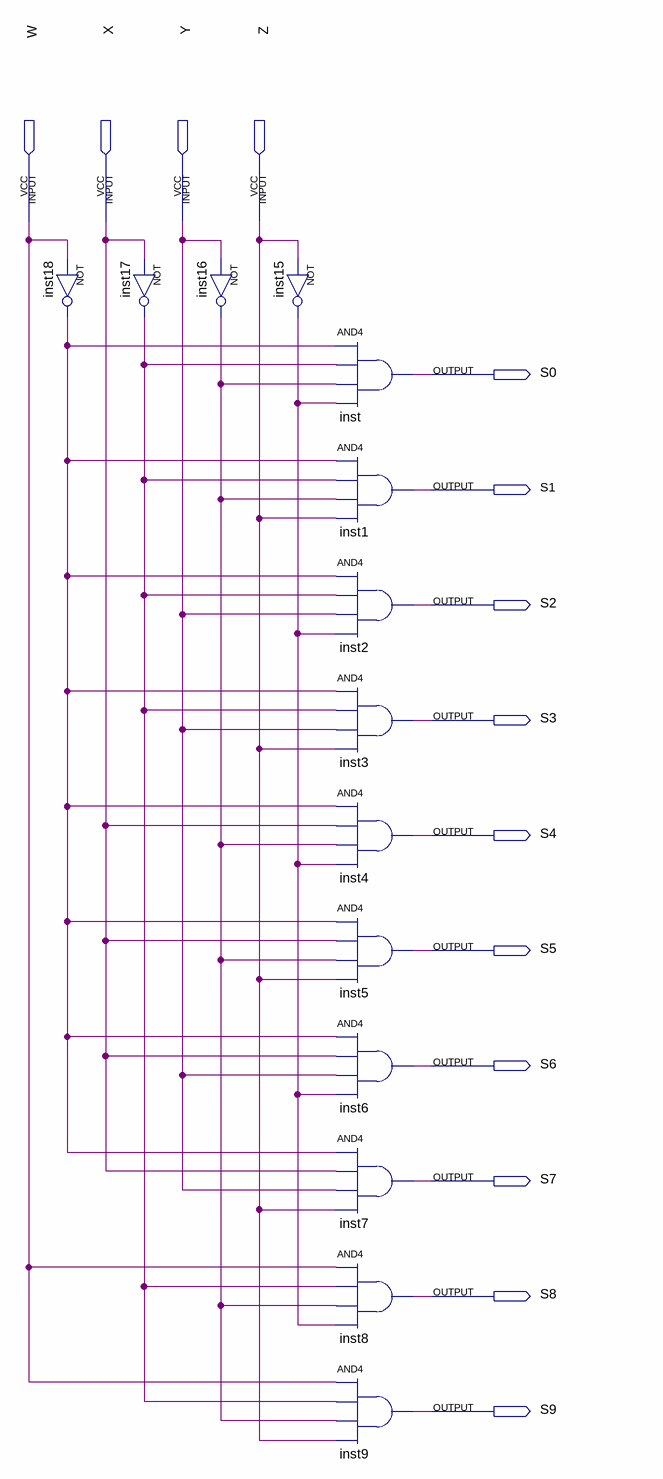
[diagram p0: schematic sheet]
// Quartus schematic Decodificador4_9.bdf as structural Verilog: 14 symbols, 14 pins
module Decodificador4_9 (
  input  W,
  input  X,
  input  Y,
  input  Z,
  output S0,
  output S1,
  output S2,
  output S3,
  output S4,
  output S5,
  output S6,
  output S7,
  output S8,
  output S9
);

  wire inst15_out, inst16_out, inst17_out, inst18_out;

  not inst18 (inst18_out, W);
  not inst17 (inst17_out, X);
  not inst16 (inst16_out, Y);
  not inst15 (inst15_out, Z);
  and inst (S0, inst18_out, inst17_out, inst16_out, inst15_out);
  and inst1 (S1, inst18_out, inst17_out, inst16_out, Z);
  and inst2 (S2, inst18_out, inst17_out, Y, inst15_out);
  and inst3 (S3, inst18_out, inst17_out, Y, Z);
  and inst4 (S4, inst18_out, X, inst16_out, inst15_out);
  and inst5 (S5, inst18_out, X, inst16_out, Z);
  and inst6 (S6, inst18_out, X, Y, inst15_out);
  and inst7 (S7, inst18_out, X, Y, Z);
  and inst8 (S8, W, inst17_out, inst16_out, inst15_out);
  and inst9 (S9, W, inst17_out, inst16_out, Z);
endmodule
